# EAGLE schematic thermal_printer (EAGLE 9.6.2)
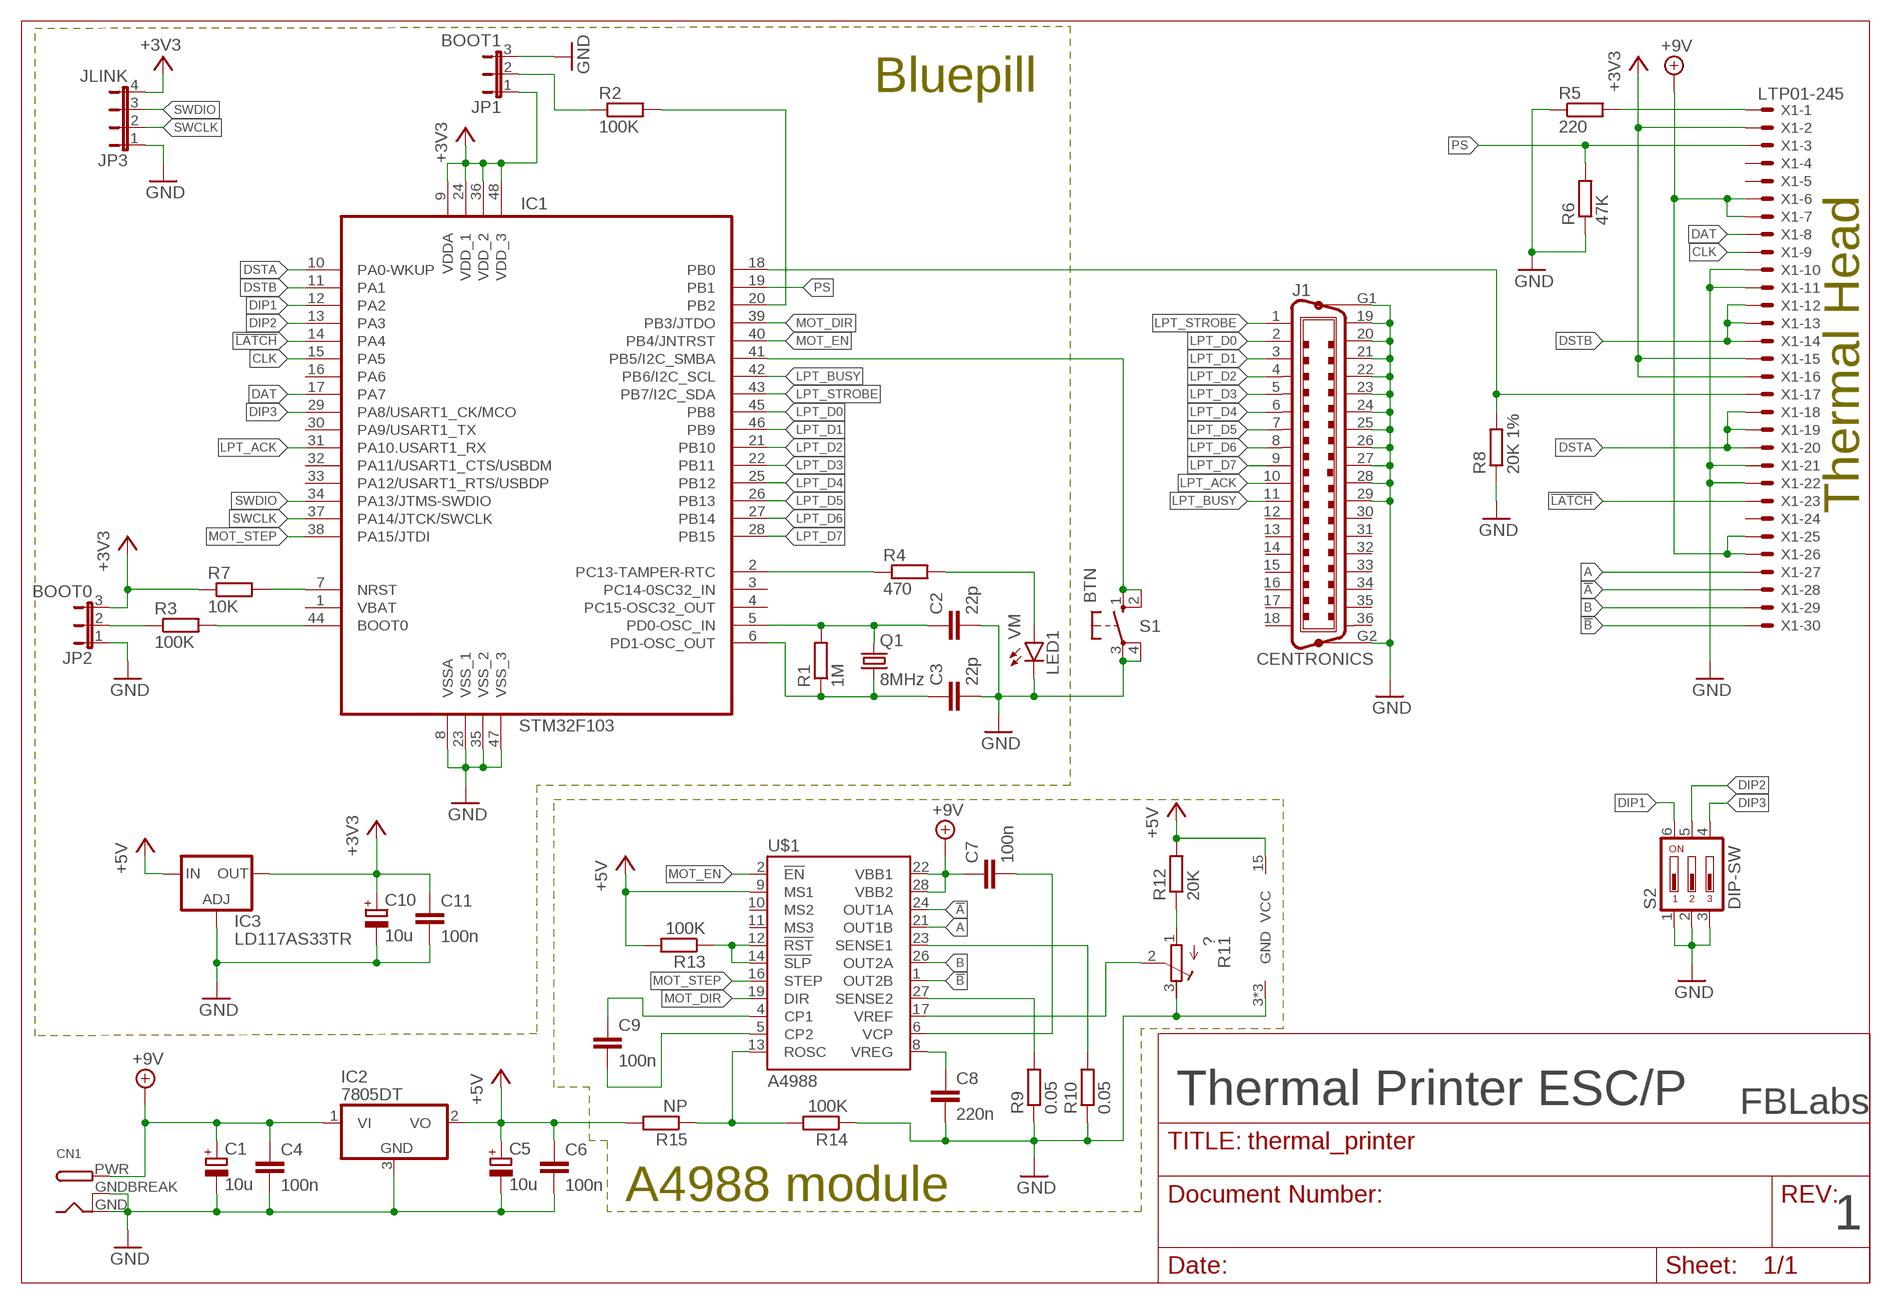
[diagram p0: schematic, sheet 1]

## Parts
C1  10u  CPOL-EUC  [PANASONIC_C]
C2  22p  C-EUC1206  [C1206]
C3  22p  C-EUC1206  [C1206]
C4  100n  C-EUC1206  [C1206]
C5  10u  CPOL-EUC  [PANASONIC_C]
C6  100n  C-EUC1206  [C1206]
C7  100n  C-EUC1206  [C1206]
C8  220n  C-EUC1206  [C1206]
C9  100n  C-EUC1206  [C1206]
C10  10u  CPOL-EUC  [PANASONIC_C]
C11  100n  C-EUC1206  [C1206]
CN1  DCBARRELPTH  [DCJACK_2MM_PTH]
IC1  STM32F103  IC_UC_STM32  [LQFP48]
IC2  7805DT  [TO252]
IC3  LD117AS33TR  [SOT223]
J1  CENTRONICS  MDR_R_36GH  [MDR_R_36GH]
JP1  BOOT1  JP2E  [JP2]
JP2  BOOT0  JP2E  [JP2]
JP3  JLINK  JP4E  [JP4]
LED1  VM  LED5MM  [LED5MM]
Q1  8MHz  CSM-7X-DU  [CSM-7X-DU]
R1  1M  R-EU_R1206  [R1206]
R2  100K  R-EU_R1206  [R1206]
R3  100K  R-EU_R1206  [R1206]
R4  470  R-EU_R1206  [R1206]
R5  220  R-EU_R1206  [R1206]
R6  47K  R-EU_R1206  [R1206]
R7  10K  R-EU_R1206  [R1206]
R8  20K 1%  R-EU_R1206  [R1206]
R9  0.05  R-EU_M3216  [M3216]
R10  0.05  R-EU_M3216  [M3216]
R11  ?  R-TRIMM4G/J  [RTRIM4G/J]
R12  20K  R-EU_R1206  [R1206]
R13  100K  R-EU_R1206  [R1206]
R14  100K  R-EU_R1206  [R1206]
R15  NP  R-EU_R1206  [R1206]
S1  BTN  10-XX  [B3F-10XX]
S2  DIP-SW  DA03  [DA-03]
U$1  A4988  [QFN-28-5MM]
X1  LTP01-245  52559-3092  [52559-3092]

## Nets
!A: U$1.24(OUT1A) X1.28
!B: U$1.1(OUT2B) X1.30
!LATCH: IC1.14(PA4) X1.23
+3V3: C10.+ C11.1 IC1.9(VDDA) IC1.24(VDD_1) IC1.36(VDD_2) IC1.48(VDD_3) IC3.4(OUT) JP1.1 JP2.3 JP3.4 R7.1 X1.2 X1.15 X1.16
+5V: C5.+ C6.1 IC2.2(VO) IC3.3(IN) R12.2 R13.2 R15.2 U$1.9(MS1) U$1.15(VCC)
+9V: C1.+ C4.1 C7.1 CN1.PWR IC2.1(VI) U$1.22(VBB1) U$1.28(VBB2) X1.6 X1.7 X1.25 X1.26
A: U$1.21(OUT1B) X1.27
B: U$1.26(OUT2A) X1.29
CLK: IC1.15(PA5) X1.9
DAT: IC1.17(PA7) X1.8
DIP1: IC1.12(PA2) S2.6
DIP2: IC1.13(PA3) S2.5
DIP3: IC1.29(PA8/USART1_CK/MCO) S2.4
DSTA: IC1.10(PA0-WKUP) X1.18 X1.19 X1.20
DSTB: IC1.11(PA1) X1.12 X1.13 X1.14
GND: C1.- C2.2 C3.2 C4.2 C5.- C6.2 C8.2 C10.- C11.2 CN1.GND CN1.GNDBREAK IC1.8(VSSA) IC1.23(VSS_1) IC1.35(VSS_2) IC1.47(VSS_3) IC2.3(GND) IC3.1(ADJ) J1.19 J1.20 J1.21 J1.22 J1.23 J1.24 J1.25 J1.26 J1.27 J1.28 J1.29 J1.G1(G) J1.G2(G1) JP1.3 JP2.1 JP3.1 LED1.K(C) R5.1 R6.1 R8.1 R9.1 R10.1 R11.3(E) R14.1 S1.3(P) S1.4(P1) S2.1 S2.2 S2.3 U$1.3(GND) U$1.18(GND) U$1.PAD(GND) X1.10 X1.11 X1.21 X1.22
GPS: R5.2 X1.1
LPT_ACK: IC1.31(PA10.USART1_RX) J1.10
LPT_BUSY: IC1.42(PB6/I2C_SCL) J1.11
LPT_D0: IC1.45(PB8) J1.2
LPT_D1: IC1.46(PB9) J1.3
LPT_D2: IC1.21(PB10) J1.4
LPT_D3: IC1.22(PB11) J1.5
LPT_D4: IC1.25(PB12) J1.6
LPT_D5: IC1.26(PB13) J1.7
LPT_D6: IC1.27(PB14) J1.8
LPT_D7: IC1.28(PB15) J1.9
LPT_STROBE: IC1.43(PB7/I2C_SDA) J1.1
MOT_DIR: IC1.39(PB3/JTDO) U$1.19(DIR)
MOT_EN: IC1.40(PB4/JNTRST) U$1.2(!EN)
MOT_STEP: IC1.38(PA15/JTDI) U$1.16(STEP)
N$1: JP1.2 R2.1
N$2: C3.1 IC1.6(PD1-OSC_OUT) Q1.1 R1.1
N$3: C2.1 IC1.5(PD0-OSC_IN) Q1.2 R1.2
N$4: IC1.20(PB2) R2.2
N$5: JP2.2 R3.1
N$6: IC1.44(BOOT0) R3.2
N$7: IC1.2(PC13-TAMPER-RTC) R4.1
N$8: LED1.A R4.2
N$9: IC1.7(NRST) R7.2
N$10: IC1.41(PB5/I2C_SMBA) S1.1(S) S1.2(S1)
N$12: R10.2 U$1.23(SENSE1)
N$13: R9.2 U$1.27(SENSE2)
N$17: C7.2 U$1.6(VCP)
N$18: R11.1(A) R12.1
N$19: C8.1 U$1.8(VREG)
N$20: R13.1 U$1.12(!RST) U$1.14(!SLP)
N$21: C9.1 U$1.4(CP1)
N$22: C9.2 U$1.5(CP2)
N$25: R11.2(S) U$1.17(VREF)
PS: IC1.19(PB1) R6.2 X1.3
ROSC: R14.2 R15.1 U$1.13(ROSC)
SWCLK: IC1.37(PA14/JTCK/SWCLK) JP3.2
SWDIO: IC1.34(PA13/JTMS-SWDIO) JP3.3
TH: IC1.18(PB0) R8.2 X1.17
Unconnected: IC1.1(VBAT) IC1.3(PC14-0SC32_IN) IC1.4(PC15-OSC32_OUT) IC1.16(PA6) IC1.30(PA9/USART1_TX) IC1.32(PA11/USART1_CTS/USBDM) IC1.33(PA12/USART1_RTS/USBDP) J1.12 J1.13 J1.14 J1.15 J1.16 J1.17 J1.18 J1.30 J1.31 J1.32 J1.33 J1.34 J1.35 J1.36 U$1.7(NC) U$1.10(MS2) U$1.11(MS3) U$1.20(NC) U$1.25(NC) X1.4 X1.5 X1.24

## Notes on the sheet
- Bluepill
- Thermal Head
- Thermal Printer ESC/P | FBLabs
- A4988 module
- 1

## Library data of the parts
C1 C5 C10 = rcl:CPOL-EU: POLARIZED CAPACITOR, European symbol
C2-C4 C6-C9 C11 = rcl:C-EU: CAPACITOR, European symbol
CN1 = adafruit:DCBARREL: 2.0mm DC Barrel Jack DCJACK_2MM_PTH - Through Hole Jack (4UConnector: 05537)
IC1 = dp_devices:IC_UC_STM32: STM32F102C6
IC2 = gm-regulators:78*: Positive VOLTAGE REGULATOR Source: http://cache.national.com/ds/LM/LM78L05.pdf http://www.fairchildsemi.com/ds/LM/LM7805.pdf
IC3 = v-reg:LD117A?*: Low drop fixed and adjustable positive voltage regulators 1 A Source: http://www.st.com/stonline/products/literature/ds/7194/ld1117axx.pdf
J1 = con-mdr-centronics:MDR_R_36G: MDR 36 pin with ground
JP1 JP2 = jumper:JP2E: JUMPER
JP3 = jumper:JP4E: JUMPER
LED1 = led:LED: LED OSRAM: - CHIPLED LG R971, LG N971, LY N971, LG Q971, LY Q971, LO R971, LY R971 LH N974, LH R974 LS Q976, LO Q976, LY Q976 LO Q996 - Hyper CHIPLED LW Q18S LB Q993, LB Q99A, LB R99A - SideLED LS A670, LO A670, LY A670, LG A670, LP A670 LB A673, LV A673, LT A673, LW A673 LH A674 LY A675 LS A676, LA A676, LO A676, LY A676, LW A676 LS A679, LY A679, LG A679 - Hyper Micro SIDELED® LS Y876, LA Y876, LO Y876, LY Y876 LT Y87S - SmartLED LW L88C, LW L88S LB L89C, LB L89S, LG L890 LS L89K, LO L89K, LY L89K LS L896, LA L896, LO L896, LY L896 - TOPLED LS T670, LO T670, LY T670, LG T670, LP T670 LSG T670, LSP T670, LSY T670, LOP T670, LYG T670 LG T671, LOG T671, LSG T671 LB T673, LV T673, LT T673, LW T673 LH T674 LS T676, LA T676, LO T676, LY T676, LB T676, LH T676, LSB T676, LW T676 LB T67C, LV T67C, LT T67C, LS T67K, LO T67K, LY T67K, LW E67C LS E67B, LA E67B, LO E67B, LY E67B, LB E67C, LV E67C, LT E67C LW T67C LS T679, LY T679, LG T679 LS T770, LO T770, LY T770, LG T770, LP T770 LB T773, LV T773, LT T773, LW T773 LH T774 LS E675, LA E675, LY E675, LS T675 LS T776, LA T776, LO T776, LY T776, LB T776 LHGB T686 LT T68C, LB T68C - Hyper Mini TOPLED® LB M676 - Mini TOPLED Santana® LG M470 LS M47K, LO M47K, LY M47K Source: http://www.osram.convergy.de LUXEON: - LUMILED® LXK2-PW12-R00, LXK2-PW12-S00, LXK2-PW14-U00, LXK2-PW14-V00 LXK2-PM12-R00, LXK2-PM12-S00, LXK2-PM14-U00 LXK2-PE12-Q00, LXK2-PE12-R00, LXK2-PE12-S00, LXK2-PE14-T00, LXK2-PE14-U00 LXK2-PB12-K00, LXK2-PB12-L00, LXK2-PB12-M00, LXK2-PB14-N00, LXK2-PB14-P00, LXK2-PB14-Q00 LXK2-PR12-L00, LXK2-PR12-M00, LXK2-PR14-Q00, LXK2-PR14-R00 LXK2-PD12-Q00, LXK2-PD12-R00, LXK2-PD12-S00 LXK2-PH12-R00, LXK2-PH12-S00 LXK2-PL12-P00, LXK2-PL12-Q00, LXK2-PL12-R00 Source: www.luxeon.com KINGBRIGHT: KA-3528ASYC Source: www.kingbright.com
Q1 = crystal:CSM-7X-DU: SMD CRYSTAL Source: www.ecsxtal.com .. Crystal 3.6864MHz CSM_7X_DU.PDF; OC_FARNELL: unknown; OC_NEWARK: unknown
R1-R8 R12-R15 = rcl:R-EU_: RESISTOR, European symbol
R9 R10 = rcl:R-EU_: RESISTOR, European symbol; SPICEPREFIX: R
R11 = rcl:R-TRIMM: Trimm resistor; SPICEMODEL: X; SPICEPREFIXL: POT
S1 = switch-omron:10-XX: OMRON SWITCH; MPN: B3F-1000; OC_FARNELL: 176432; OC_NEWARK: 36M3542
S2 = switch-dil:DA03: DIL/CODE SWITCH; MPN: MCDA03; OC_FARNELL: 1521999; OC_NEWARK: 74M2972
U$1 = Allegro:A4988: A4988 - Steppen motor driver
X1 = con-molex:52559-3092: FFC/FPC-to-Board 0.50mm (.020") SMT, Vertical, ZIF Receptacle Source: http://www.molex.com/product/ffc/52559.html; MF: MOLEX; MPN: 52559-3072; OC_FARNELL: unknown; OC_NEWARK: 57J3632